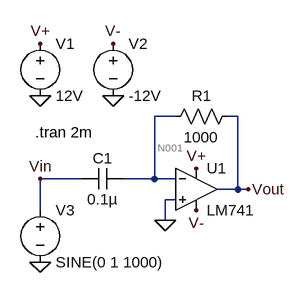
[diagram p0: schematic differentiator.asc]
differentiator.asc, the LTspice schematic file:
Version 4
SHEET 1 880 680
WIRE 224 112 192 112
WIRE 320 112 304 112
WIRE 80 208 16 208
WIRE 192 208 192 112
WIRE 192 208 144 208
WIRE 224 208 192 208
WIRE 320 224 320 112
WIRE 320 224 288 224
WIRE 336 224 320 224
WIRE 224 240 208 240
WIRE 16 256 16 208
WIRE 208 272 208 240
FLAG 128 80 0
FLAG 16 80 0
FLAG 208 272 0
FLAG 16 336 0
FLAG 256 192 V+
FLAG 16 0 V+
FLAG 128 0 V-
FLAG 256 256 V-
FLAG 336 224 Vout
FLAG 16 208 Vin
SYMBOL res 320 96 R90
WINDOW 0 0 56 VBottom 2
WINDOW 3 32 56 VTop 2
SYMATTR InstName R1
SYMATTR Value 1000
SYMBOL cap 144 192 R90
WINDOW 0 0 32 VBottom 2
WINDOW 3 32 32 VTop 2
SYMATTR InstName C1
SYMATTR Value 0.1µ
SYMBOL voltage 16 -16 R0
SYMATTR InstName V1
SYMATTR Value 12V
SYMBOL voltage 128 -16 R0
SYMATTR InstName V2
SYMATTR Value -12V
SYMBOL voltage 16 240 R0
WINDOW 123 0 0 Left 0
WINDOW 39 0 0 Left 0
SYMATTR InstName V3
SYMATTR Value SINE(0 1 1000)
SYMBOL Opamps\\LM741 256 160 R0
SYMATTR InstName U1
TEXT 8 136 Left 2 !.tran 2m

The netlist it stands for:
* differentiator.asc
R1 Vout N001 1000
C1 N001 Vin 0.1µ
V1 V+ 0 12V
V2 V- 0 -12V
V3 Vin 0 SINE(0 1 1000)
XU1 0 N001 V+ V- Vout LM741  ; pins In+ In- V+ V- OUT
.tran 2m
.lib LM741.lib
.backanno
.end

* Results of the author's LTspice run, read from the files saved beside the schematic
* Operating Point, zero values left out:
*   V(vout) = 1.102 mV
*   V(n001) = 1 mV
*   V(v+) = 12 V
*   V(v-) = -12 V
*   I(R1) = 101.9 nA
*   I(V2) = 1.626 mA
*   I(V1) = -1.626 mA
*   Ix(u1:1) = 57.86 nA
*   Ix(u1:2) = 101.9 nA
*   Ix(u1:99) = 1.626 mA
*   Ix(u1:50) = -1.626 mA
*   Ix(u1:28) = -101.9 nA
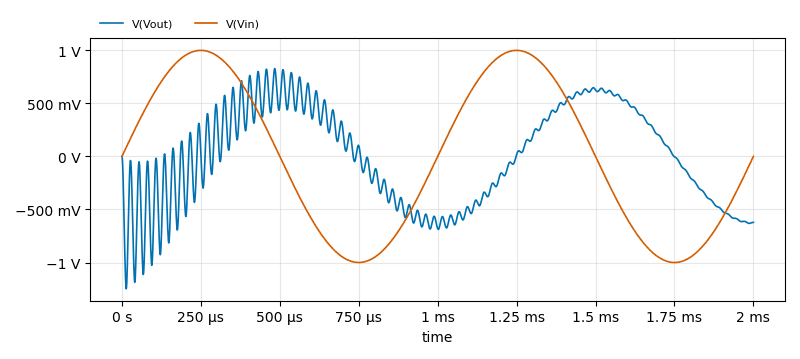
[diagram p1: Transient Analysis of differentiator.asc, plotted from the saved traces]
* Transient Analysis, 1 run:
*   V(Vout): min -1.248 V, max 828 mV, average 1.312 mV, rms 466.5 mV, last -621.7 mV
*   V(Vin): min -1 V, max 1 V, average 1.368 µV, rms 707.1 mV, last 0 V